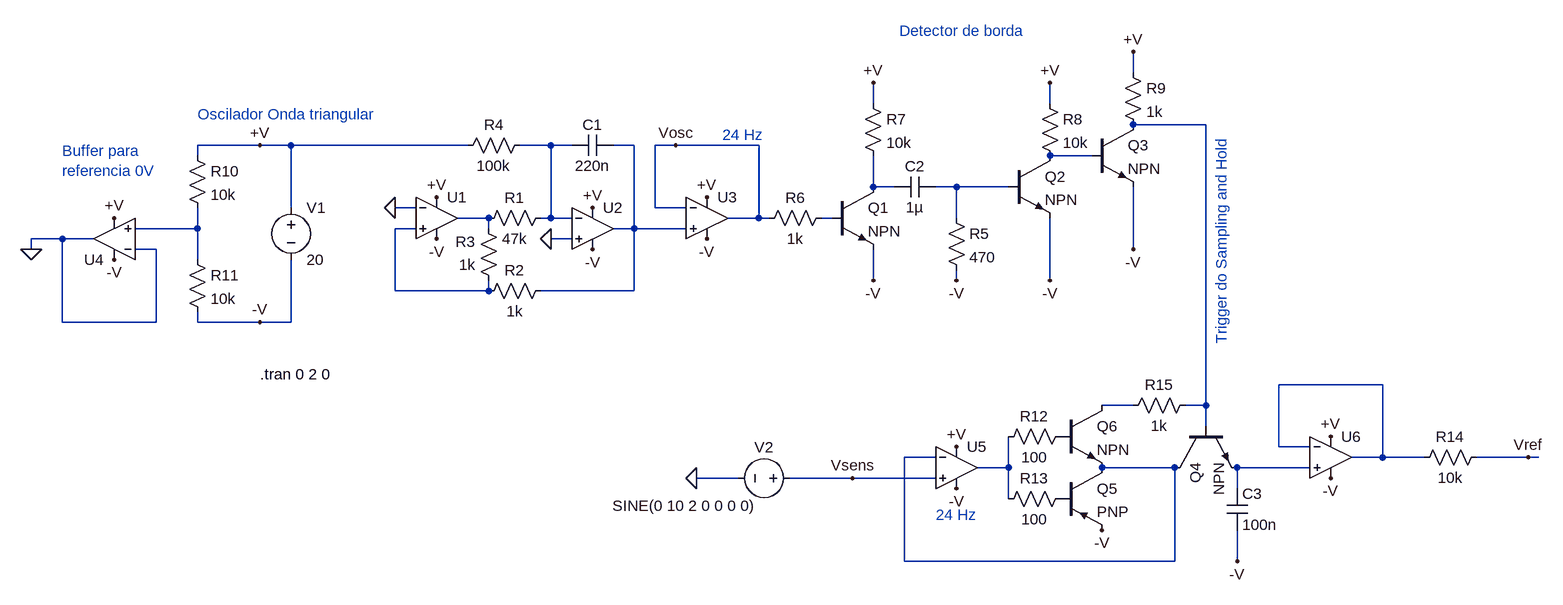
[diagram p0: schematic Oscilador_para_sensor_rodas+reset.asc]
Oscilador_para_sensor_rodas+reset.asc, the LTspice schematic file:
Version 4
SHEET 1 2440 680
WIRE 1168 -144 1168 -176
WIRE 768 -96 768 -128
WIRE 1040 -96 1040 -128
WIRE 1280 -64 1168 -64
WIRE -176 -32 -272 -32
WIRE -128 -32 -176 -32
WIRE 144 -32 -128 -32
WIRE 272 -32 224 -32
WIRE 304 -32 272 -32
WIRE 400 -32 368 -32
WIRE 464 -32 432 -32
WIRE 592 -32 464 -32
WIRE -272 -16 -272 -32
WIRE 1104 -16 1040 -16
WIRE 768 32 768 -16
WIRE 800 32 768 32
WIRE 896 32 864 32
WIRE 976 32 896 32
WIRE -128 64 -128 -32
WIRE 64 64 32 64
WIRE 432 64 432 -32
WIRE 480 64 432 64
WIRE 176 80 128 80
WIRE 272 80 272 -32
WIRE 272 80 256 80
WIRE 304 80 272 80
WIRE 592 80 592 -32
WIRE 592 80 544 80
WIRE 608 80 592 80
WIRE 704 80 688 80
WIRE 896 80 896 32
WIRE -272 96 -272 64
WIRE -272 96 -368 96
WIRE 64 96 32 96
WIRE 176 96 176 80
WIRE 400 96 400 -32
WIRE 400 96 368 96
WIRE 480 96 400 96
WIRE -480 112 -528 112
WIRE -432 112 -480 112
WIRE 304 112 272 112
WIRE -528 128 -528 112
WIRE -336 128 -368 128
WIRE 1168 128 1168 32
WIRE -272 144 -272 96
WIRE 768 176 768 128
WIRE 896 176 896 160
WIRE 1040 176 1040 80
WIRE 32 192 32 96
WIRE 176 192 176 176
WIRE 176 192 32 192
WIRE 400 192 400 96
WIRE 400 192 256 192
WIRE -480 240 -480 112
WIRE -336 240 -336 128
WIRE -336 240 -480 240
WIRE -272 240 -272 224
WIRE -176 240 -272 240
WIRE -128 240 -128 144
WIRE -128 240 -176 240
WIRE 1552 336 1392 336
WIRE 1168 368 1120 368
WIRE 1280 368 1280 -64
WIRE 1280 368 1248 368
WIRE 1280 400 1280 368
WIRE 1392 432 1392 336
WIRE 1440 432 1392 432
WIRE 864 448 816 448
WIRE 1552 448 1552 336
WIRE 1552 448 1504 448
WIRE 1616 448 1552 448
WIRE 1776 448 1696 448
WIRE 1792 448 1776 448
WIRE 976 464 976 416
WIRE 976 464 928 464
WIRE 1232 464 1120 464
WIRE 1440 464 1328 464
WIRE 560 480 496 480
WIRE 736 480 640 480
WIRE 864 480 736 480
WIRE 1328 496 1328 464
WIRE 976 512 976 464
WIRE 816 608 816 448
WIRE 1232 608 1232 464
WIRE 1232 608 816 608
WIRE 1328 608 1328 560
FLAG 272 112 0
FLAG -176 240 -V
FLAG 96 112 -V
FLAG 336 128 -V
FLAG 336 64 +V
FLAG 96 48 +V
FLAG 32 64 0
FLAG 464 -32 Vosc
FLAG 512 112 -V
FLAG 512 48 +V
FLAG 1040 -128 +V
FLAG 768 -128 +V
FLAG 768 176 -V
FLAG 896 176 -V
FLAG 1040 176 -V
FLAG 1168 -176 +V
FLAG 1168 128 -V
FLAG -176 -32 +V
FLAG -528 128 0
FLAG -400 144 -V
FLAG -400 80 +V
FLAG 736 480 Vsens
FLAG 896 496 -V
FLAG 896 432 +V
FLAG 496 480 0
FLAG 1120 560 -V
FLAG 1776 448 Vref
FLAG 1328 608 -V
FLAG 1472 480 -V
FLAG 1472 416 +V
SYMBOL OpAmps\\UniversalOpAmp2 96 80 R0
SYMATTR InstName U1
SYMBOL OpAmps\\UniversalOpAmp2 336 96 R0
SYMATTR InstName U2
SYMBOL res 272 64 R90
WINDOW 0 0 56 VBottom 2
WINDOW 3 32 56 VTop 2
SYMATTR InstName R1
SYMATTR Value 47k
SYMBOL res 272 176 R90
WINDOW 0 0 56 VBottom 2
WINDOW 3 32 56 VTop 2
SYMATTR InstName R2
SYMATTR Value 1k
SYMBOL res 192 192 R180
WINDOW 0 36 76 Left 2
WINDOW 3 36 40 Left 2
SYMATTR InstName R3
SYMATTR Value 1k
SYMBOL cap 368 -48 R90
WINDOW 0 0 32 VBottom 2
WINDOW 3 32 32 VTop 2
SYMATTR InstName C1
SYMATTR Value 220n
SYMBOL res 240 -48 R90
WINDOW 0 0 56 VBottom 2
WINDOW 3 32 56 VTop 2
SYMATTR InstName R4
SYMATTR Value 100k
SYMBOL OpAmps\\UniversalOpAmp2 512 80 R0
SYMATTR InstName U3
SYMBOL cap 864 16 R90
WINDOW 0 0 32 VBottom 2
WINDOW 3 32 32 VTop 2
SYMATTR InstName C2
SYMATTR Value 1µ
SYMBOL res 880 64 R0
SYMATTR InstName R5
SYMATTR Value 470
SYMBOL npn 704 32 R0
SYMATTR InstName Q1
SYMBOL npn 976 -16 R0
SYMATTR InstName Q2
SYMBOL res 752 -112 R0
SYMATTR InstName R7
SYMATTR Value 10k
SYMBOL res 1024 -112 R0
SYMATTR InstName R8
SYMATTR Value 10k
SYMBOL res 704 64 R90
WINDOW 0 0 56 VBottom 2
WINDOW 3 32 56 VTop 2
SYMATTR InstName R6
SYMATTR Value 1k
SYMBOL npn 1104 -64 R0
SYMATTR InstName Q3
SYMBOL res 1152 -160 R0
SYMATTR InstName R9
SYMATTR Value 1k
SYMBOL OpAmps\\UniversalOpAmp2 -400 112 R180
SYMATTR InstName U4
SYMBOL voltage -128 48 R0
WINDOW 123 0 0 Left 0
WINDOW 39 0 0 Left 0
SYMATTR InstName V1
SYMATTR Value 20
SYMBOL res -288 -32 R0
SYMATTR InstName R10
SYMATTR Value 10k
SYMBOL res -288 128 R0
SYMATTR InstName R11
SYMATTR Value 10k
SYMBOL OpAmps\\UniversalOpAmp2 896 464 R0
SYMATTR InstName U5
SYMBOL voltage 656 480 R90
WINDOW 0 -32 56 VBottom 2
WINDOW 3 27 179 VTop 2
WINDOW 123 0 0 Left 0
WINDOW 39 0 0 Left 0
SYMATTR InstName V2
SYMATTR Value SINE(0 10 2 0 0 0 0)
SYMBOL cap 1312 496 R0
SYMATTR InstName C3
SYMATTR Value 100n
SYMBOL res 1072 400 R90
WINDOW 0 0 56 VBottom 2
WINDOW 3 32 56 VTop 2
SYMATTR InstName R12
SYMATTR Value 100
SYMBOL pnp 1056 464 R0
SYMATTR InstName Q5
SYMBOL res 1072 496 R90
WINDOW 0 0 56 VBottom 2
WINDOW 3 32 56 VTop 2
SYMATTR InstName R13
SYMATTR Value 100
SYMBOL npn 1056 368 R0
SYMATTR InstName Q6
SYMBOL OpAmps\\UniversalOpAmp2 1472 448 R0
SYMATTR InstName U6
SYMBOL res 1712 432 R90
WINDOW 0 0 56 VBottom 2
WINDOW 3 32 56 VTop 2
SYMATTR InstName R14
SYMATTR Value 10k
SYMBOL npn 1232 400 M90
SYMATTR InstName Q4
SYMBOL res 1264 352 R90
WINDOW 0 0 56 VBottom 2
WINDOW 3 32 56 VTop 2
SYMATTR InstName R15
SYMATTR Value 1k
TEXT -176 320 Left 2 !.tran 0 2 0
TEXT 536 -48 Left 2 ;24 Hz
TEXT 808 -208 Left 2 ;Detector de borda
TEXT -272 -80 Left 2 ;Oscilador Onda triangular
TEXT -480 -24 Left 2 ;Buffer para \nreferencia 0V
TEXT 864 536 Left 2 ;24 Hz
TEXT 1304 -48 VRight 2 ;Trigger do Sampling and Hold

The netlist it stands for:
* Oscilador_para_sensor_rodas+reset.asc
XU1 N010 0 +V -V N007 level2 Avol=1Meg GBW=10Meg Slew=10Meg Ilimit=25m Rail=0 Vos=0 En=0 Enk=0 In=0 Ink=0 Rin=500Meg  ; pins In+ In- V+ V- OUT
XU2 0 N002 +V -V N003 level2 Avol=1Meg GBW=10Meg Slew=10Meg Ilimit=25m Rail=0 Vos=0 En=0 Enk=0 In=0 Ink=0 Rin=500Meg  ; pins In+ In- V+ V- OUT
R1 N002 N007 47k
R2 N003 N010 1k
R3 N010 N007 1k
C1 N003 N002 220n
R4 N002 +V 100k
XU3 N003 Vosc +V -V Vosc level2 Avol=1Meg GBW=10Meg Slew=10Meg Ilimit=25m Rail=0 Vos=0 En=0 Enk=0 In=0 Ink=0 Rin=500Meg  ; pins In+ In- V+ V- OUT
C2 N006 N005 1µ
R5 N006 -V 470
Q1 N005 N008 -V 0 NPN
Q2 N004 N006 -V 0 NPN
R7 +V N005 10k
R8 +V N004 10k
R6 N008 Vosc 1k
Q3 N001 N004 -V 0 NPN
R9 +V N001 1k
XU4 N009 0 -V +V 0 level2 Avol=1Meg GBW=10Meg Slew=10Meg Ilimit=25m Rail=0 Vos=0 En=0 Enk=0 In=0 Ink=0 Rin=500Meg  ; pins In+ In- V+ V- OUT
V1 +V -V 20
R10 +V N009 10k
R11 N009 -V 10k
XU5 Vsens N013 +V -V N014 level2 Avol=1Meg GBW=10Meg Slew=10Meg Ilimit=25m Rail=0 Vos=0 En=0 Enk=0 In=0 Ink=0 Rin=500Meg  ; pins In+ In- V+ V- OUT
V2 Vsens 0 SINE(0 10 2 0 0 0 0)
C3 N015 -V 100n
R12 P001 N014 100
Q5 N013 P002 -V 0 PNP
R13 P002 N014 100
Q6 N012 P001 N013 0 NPN
XU6 N015 N011 +V -V N011 level2 Avol=1Meg GBW=10Meg Slew=10Meg Ilimit=25m Rail=0 Vos=0 En=0 Enk=0 In=0 Ink=0 Rin=500Meg  ; pins In+ In- V+ V- OUT
R14 Vref N011 10k
Q4 N013 N001 N015 0 NPN
R15 N001 N012 1k
.model NPN NPN
.model PNP PNP
.lib standard.bjt
.tran 0 2 0
* 24 Hz
* Detector de borda
* Oscilador Onda triangular
* Buffer para
* referencia 0V
* 24 Hz
* Trigger do Sampling and Hold
.lib UniversalOpAmp2.lib
.backanno
.end